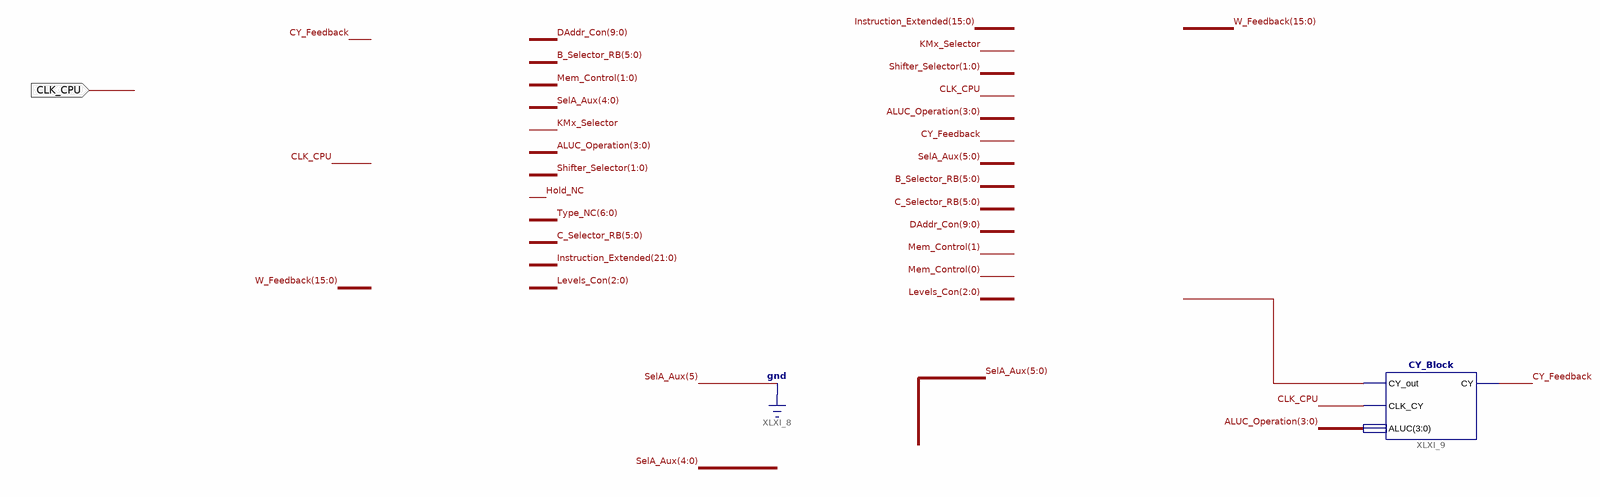
[diagram p0: schematic sheet 1]
// Xilinx ISE schematic CPU_main.sch (artix7) as structural Verilog: 1 symbols, 1 ports
module CPU_main (
  input  CLK_CPU
);

  wire CY_Feedback, XLXN_53;
  wire [3:0] ALUC_Operation;

  CY_Block XLXI_9 (.CY_out(XLXN_53), .CLK_CY(CLK_CPU), .ALUC(ALUC_Operation), .CY(CY_Feedback));
endmodule
